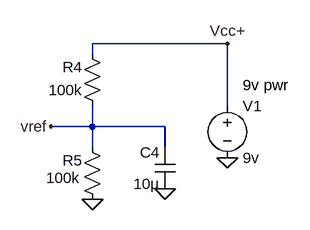
[diagram p0: schematic vref_circuit.asc]
vref_circuit.asc, the LTspice schematic file:
Version 4
SHEET 1 1336 916
WIRE 256 656 48 656
WIRE 48 672 48 656
WIRE 256 752 256 656
WIRE 48 784 48 752
WIRE 48 784 -16 784
WIRE 160 784 48 784
WIRE 48 816 48 784
WIRE 160 816 160 784
FLAG 48 896 0
FLAG 160 880 0
FLAG 256 832 0
FLAG 256 656 Vcc+
FLAG -16 784 vref
SYMBOL cap 176 880 R180
WINDOW 0 24 56 Left 2
WINDOW 3 24 8 Left 2
SYMATTR InstName C4
SYMATTR Value 10µ
SYMBOL res 64 768 R180
WINDOW 0 31 76 Left 2
WINDOW 3 31 40 Left 2
SYMATTR InstName R4
SYMATTR Value 100k
SYMBOL res 64 912 R180
WINDOW 0 31 76 Left 2
WINDOW 3 35 49 Left 2
SYMATTR InstName R5
SYMATTR Value 100k
SYMBOL voltage 256 736 R0
WINDOW 123 0 0 Left 0
WINDOW 39 0 0 Left 0
SYMATTR InstName V1
SYMATTR Value 9v
TEXT 280 720 Left 2 !9v pwr

The netlist it stands for:
* vref_circuit.asc
C4 0 vref 10µ
R4 vref Vcc+ 100k
R5 0 vref 100k
V1 Vcc+ 0 9v
9v pwr
.backanno
.end